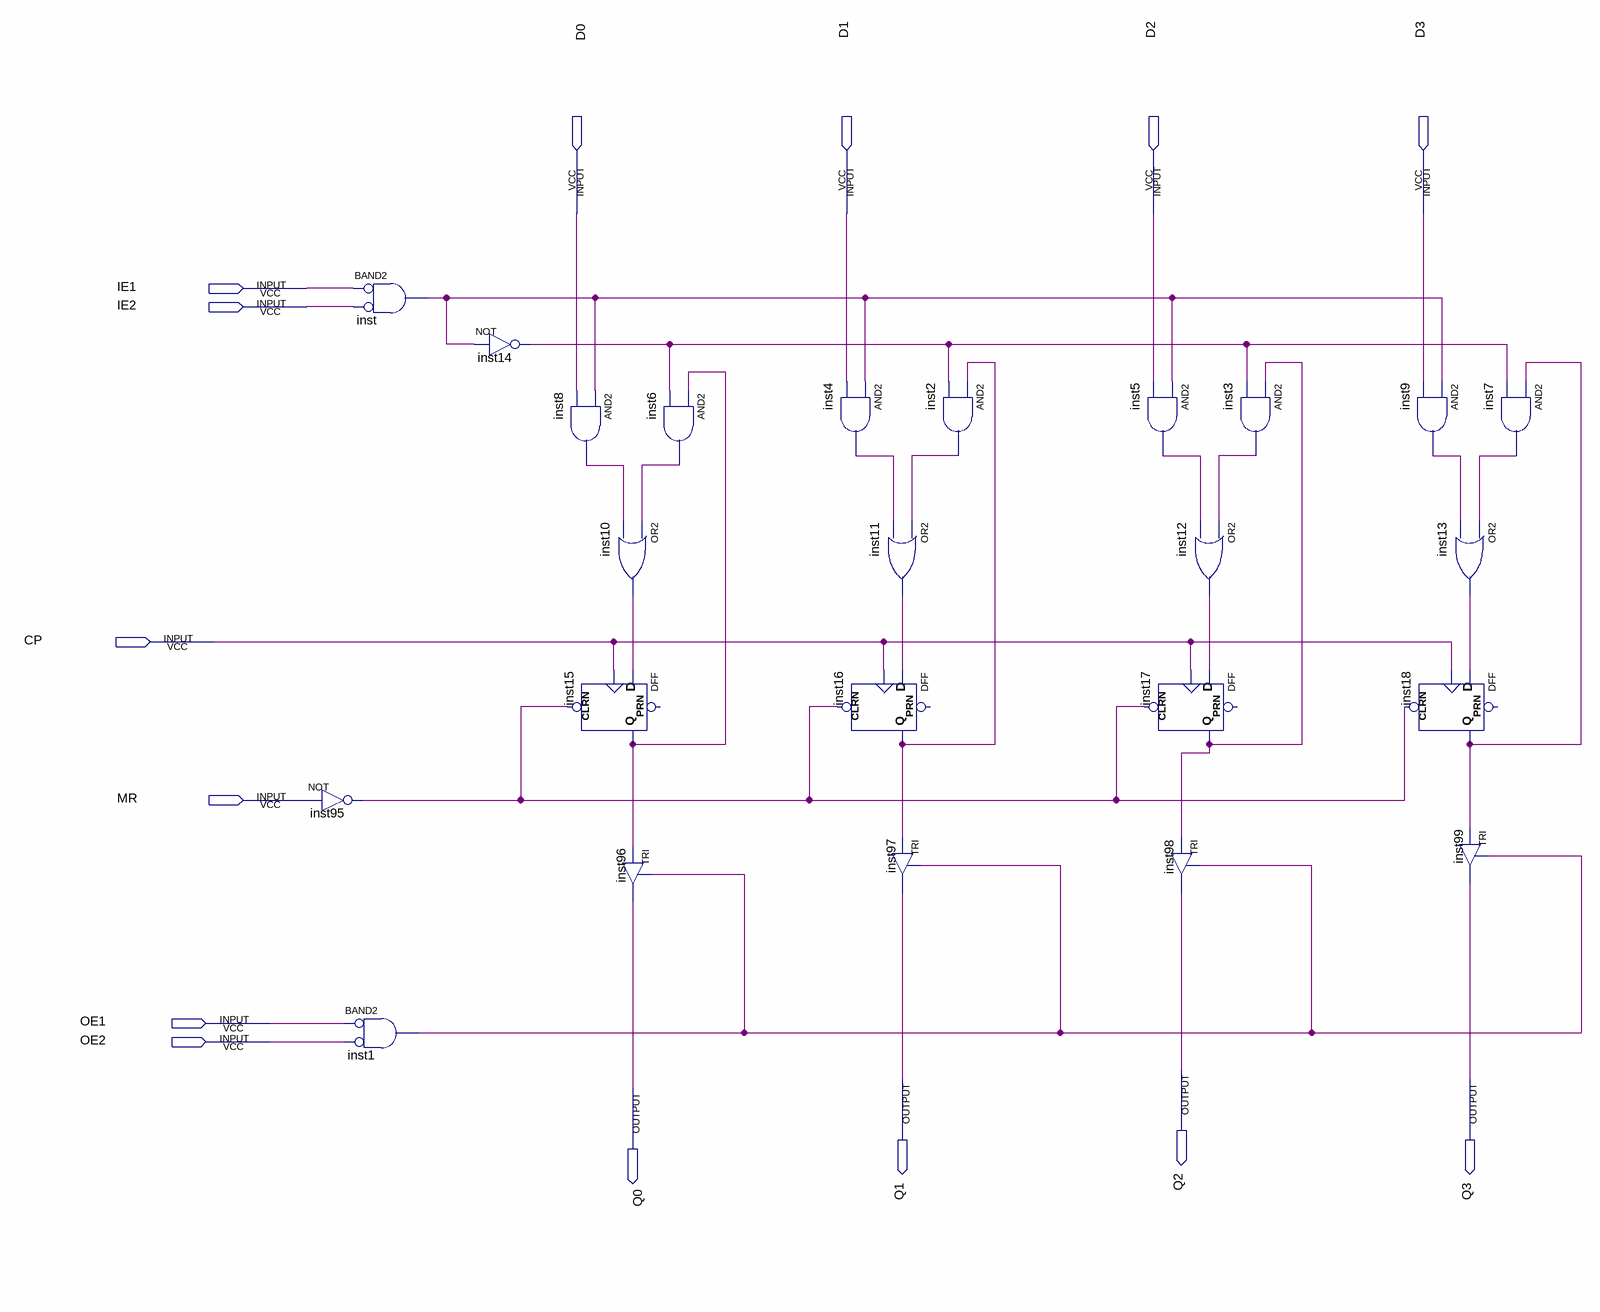
[diagram p0: schematic sheet]
// Quartus schematic CI74LS173A_REGISTRADOR_TRISTATE.bdf as structural Verilog: 24 symbols, 14 pins
module CI74LS173A_REGISTRADOR_TRISTATE (
  input  D0,
  input  D1,
  input  D2,
  input  D3,
  input  IE1,
  input  IE2,
  input  CP,
  input  MR,
  input  OE1,
  input  OE2,
  output Q2,
  output Q1,
  output Q3,
  output Q0
);

  wire inst1_out, inst2_out, inst3_out, inst4_out, inst5_out, inst6_out, inst7_out, inst8_out, inst9_out,
       inst10_out, inst11_out, inst12_out, inst13_out, inst14_out, inst15_q, inst16_q, inst17_q, inst18_q,
       inst95_out, inst_out;

  and inst (inst_out, ~IE1, ~IE2);  // BAND2
  not inst95 (inst95_out, MR);
  and inst1 (inst1_out, ~OE1, ~OE2);  // BAND2
  not inst14 (inst14_out, inst_out);
  and inst8 (inst8_out, inst_out, D0);
  DFF inst15 (.CLRN(inst95_out), .CLK(CP), .D(inst10_out), .Q(inst15_q));  // open: PRN
  and inst6 (inst6_out, inst15_q, inst14_out);
  or inst10 (inst10_out, inst6_out, inst8_out);
  TRI inst96 (.IN(inst15_q), .OE(inst1_out), .OUT(Q0));
  and inst4 (inst4_out, inst_out, D1);
  or inst11 (inst11_out, inst2_out, inst4_out);
  DFF inst16 (.CLRN(inst95_out), .CLK(CP), .D(inst11_out), .Q(inst16_q));  // open: PRN
  TRI inst97 (.IN(inst16_q), .OE(inst1_out), .OUT(Q1));
  and inst2 (inst2_out, inst16_q, inst14_out);
  and inst5 (inst5_out, inst_out, D2);
  or inst12 (inst12_out, inst3_out, inst5_out);
  DFF inst17 (.CLRN(inst95_out), .CLK(CP), .D(inst12_out), .Q(inst17_q));  // open: PRN
  TRI inst98 (.IN(inst17_q), .OE(inst1_out), .OUT(Q2));
  and inst3 (inst3_out, inst17_q, inst14_out);
  and inst9 (inst9_out, inst_out, D3);
  DFF inst18 (.CLRN(inst95_out), .CLK(CP), .D(inst13_out), .Q(inst18_q));  // open: PRN
  or inst13 (inst13_out, inst7_out, inst9_out);
  TRI inst99 (.IN(inst18_q), .OE(inst1_out), .OUT(Q3));
  and inst7 (inst7_out, inst18_q, inst14_out);
endmodule
